# Altium schematic sheet TopLevel.SchDoc
size A4
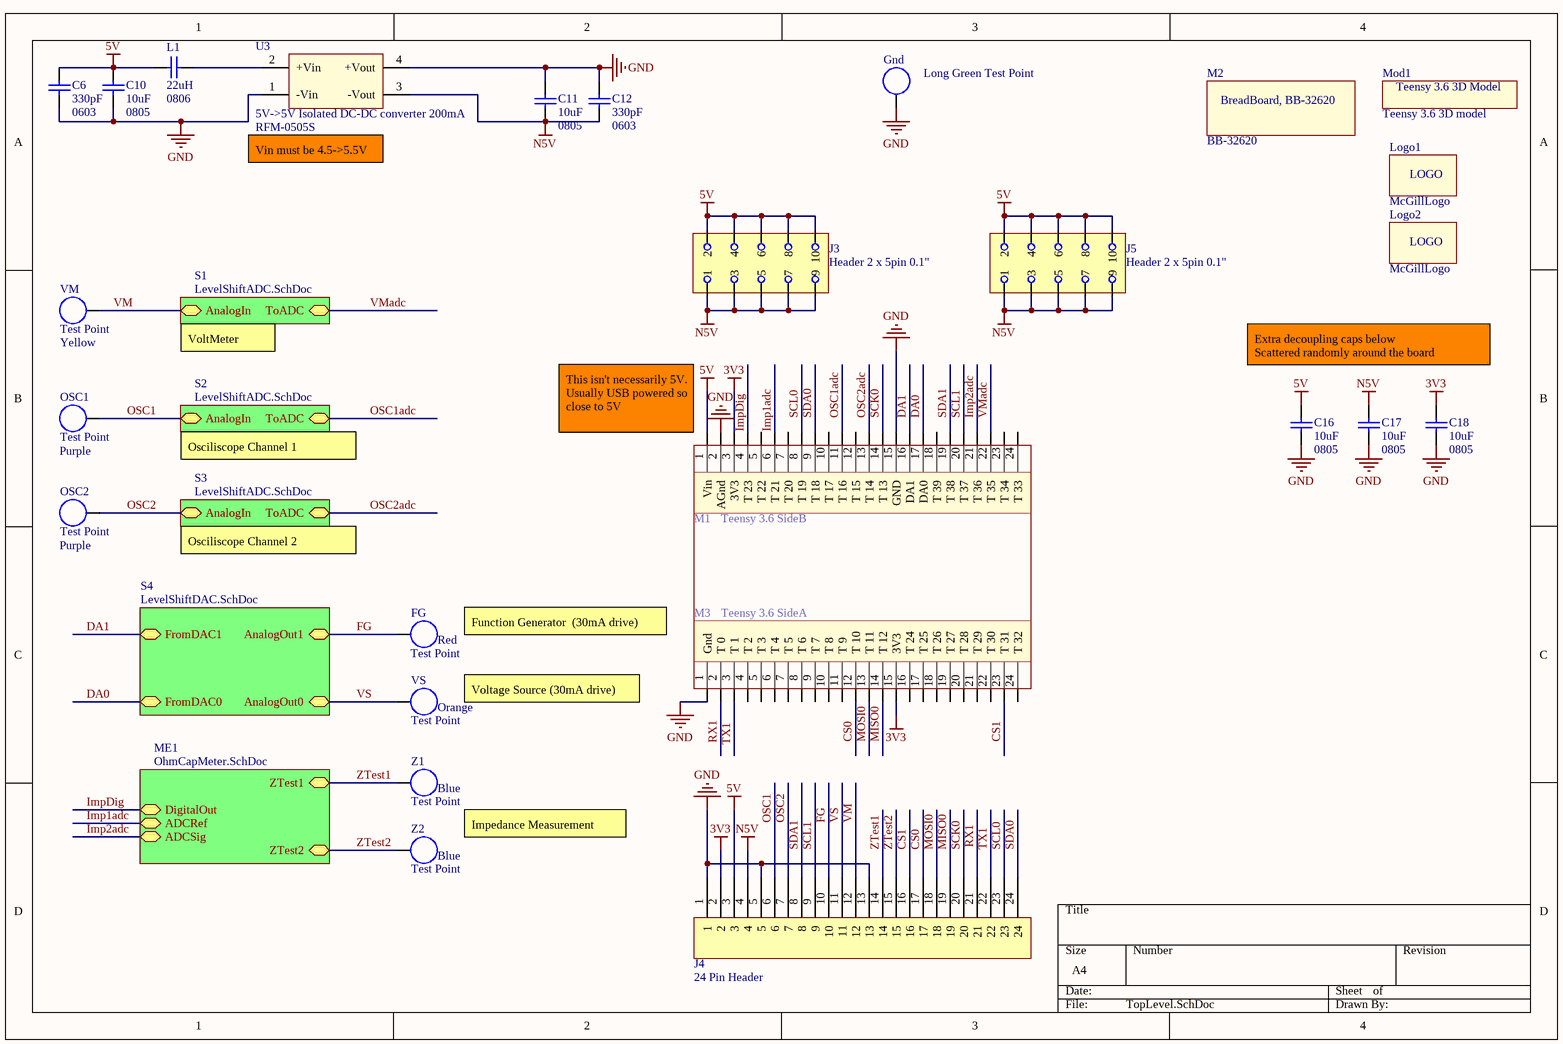
[diagram p0: TopLevel.SchDoc]

## Parts
C6  330pF  [0603]
C10  10uF  [0805]
C11  10uF  [0805]
C12  330pF  [0603]
C16  10uF  [0805]
C17  10uF  [0805]
C18  10uF  [0805]
FG  Test Point  Param: Red  [TestPoint]
Gnd  Long Green Test Point  [TestPoint]
J3  Header 2 x 5pin 0.1"  [Header2x5]
J4  24 Pin Header  [Header24Male]
J5  Header 2 x 5pin 0.1"  [Header2x5]
L1  22uH  [0806]
Logo1  McGillLogo  [McGillLogo1]  (no BOM)
Logo2  McGillLogo  [McGillLogo1]  (no BOM)
M1  Teensy 3.6 SideB  [Header24Female]
M2  BB-32620  (mechanical)
M3  Teensy 3.6 SideA  [Header24Female]
Mod1  Teensy 3.6 3D model  [Teensy3.6 Model No pins]  (no BOM)
OSC1  Test Point  Param: Purple  [TestPoint]
OSC2  Test Point  Param: Purple  [TestPoint]
U3  RFM-0505S  [RFM-0505S]
VM  Test Point  Param: Yellow  [TestPoint]
VS  Test Point  Param: Orange  [TestPoint]
Z1  Test Point  Param: Blue  [TestPoint]
Z2  Test Point  Param: Blue  [TestPoint]

## Sub-sheets
ME1 = OhmCapMeter.SchDoc: DigitalOut, ADCRef, ADCSig, ZTest2, ZTest1
S1 = LevelShiftADC.SchDoc: AnalogIn, ToADC
S2 = LevelShiftADC.SchDoc: AnalogIn, ToADC
S3 = LevelShiftADC.SchDoc: AnalogIn, ToADC
S4 = LevelShiftDAC.SchDoc: FromDAC1, FromDAC0, AnalogOut1, AnalogOut0

## Nets
3V3: C18.2 J4.2 M1.3(3V3) M3.15(3V3)
5V: C6.1 C10.2 C16.2 J3.2 J3.4 J3.6 J3.8 J3.10 J4.3 J5.2 J5.4 J5.6 J5.8 J5.10 L1.1 M1.1(Vin)
GND: C6.2 C10.1 C11.2 C12.1 C16.1 C17.1 C18.1 Gnd.0 J4.1 J4.5 J4.13 M1.2(AGnd) M1.15(GND) M3.1(Gnd) U3.1(-Vin) U3.4(+Vout)
N5V: C11.1 C12.2 C17.2 J3.1 J3.3 J3.5 J3.7 J3.9 J4.4 J5.1 J5.3 J5.5 J5.7 J5.9 U3.3(-Vout)
CS0: J4.17 M3.12(T_10)
CS1: J4.16 M3.23(T_31)
DA0: M1.17(DA0) ; sheet S4/FromDAC0
DA1: M1.16(DA1) ; sheet S4/FromDAC1
FG: FG.0 J4.10 ; sheet S4/AnalogOut1
Imp1adc: M1.6(T_21) ; sheet ME1/ADCRef
Imp2adc: M1.21(T_36) ; sheet ME1/ADCSig
ImpDig: M1.4(T_23) ; sheet ME1/DigitalOut
MISO0: J4.19 M3.14(T_12)
MOSI0: J4.18 M3.13(T_11)
OSC1: J4.6 OSC1.0 ; sheet S2/AnalogIn
OSC1adc: M1.11(T_16) ; sheet S2/ToADC
OSC2: J4.7 OSC2.0 ; sheet S3/AnalogIn
OSC2adc: M1.13(T_14) ; sheet S3/ToADC
RX1: J4.21 M3.2(T_0)
SCK0: J4.20 M1.14(T_13)
SCL0: J4.23 M1.8(T_19)
SCL1: J4.9 M1.20(T_37)
SDA0: J4.24 M1.9(T_18)
SDA1: J4.8 M1.19(T_38)
TX1: J4.22 M3.3(T_1)
VM: J4.12 VM.0 ; sheet S1/AnalogIn
VMadc: M1.22(T_35) ; sheet S1/ToADC
VS: J4.11 VS.0 ; sheet S4/AnalogOut0
ZTest1: J4.14 Z1.0 ; sheet ME1/ZTest1
ZTest2: J4.15 Z2.0 ; sheet ME1/ZTest2
NetL1_2: L1.2 U3.2(+Vin)

Not connected (* = marked no-connect by the designer): M1 5(T_22) 7(T_20) 10(T_17) 12(T_15) 18(T_39) 23(T_34) 24(T_33); M3 4(T_2) 5(T_3) 6(T_4) 7(T_5) 8(T_6) 9(T_7) 10(T_8) 11(T_9) 16(T_24) 17(T_25) 18(T_26) 19(T_27) 20(T_28) 21(T_29) 22(T_30) 24(T_32)

## Notes on the sheet
- (near U3) Vin must be 4.5->5.5V
- VoltMeter
- Extra decoupling caps below
  Scattered randomly around the board
- Osciliscope Channel 1
- (near M1) This isn't necessarily 5V. Usually USB powered so close to 5V
- Osciliscope Channel 2
- Function Generator  (30mA drive)
- Voltage Source (30mA drive)
- Impedance Measurement
- (in symbol BreadBoard) BreadBoard, BB-32620
- (in symbol Logo) LOGO
- (in symbol RFM-0505S) 5V->5V Isolated DC-DC converter 200mA
- (in symbol Teensy 3.6 3D model) Teensy 3.6 3D Model

## Library data of the parts
C6 C12 = Cap0603: Capacitor, Ceramic, 0603; Manufacturer: Yageo; Manufacturers Part Number: CC0603KRX7R9BB331; Assembly Comments: none; Loaded: True; Value: 330pF, 50V; TechInf: *; Param1: *; Part constraints: CC0603KRX7R9BB331; Supplier 1: Digi-Key; Supplier Part Number 1: 311-1186-1-ND; SupplierUnitCost: $0.0449
C10 C11 C16-C18 = Cap0805: 0805; Manufacturer: Taiyo Yuden; Part constraints: EMK212BJ106KG-T; Assembly Comments: none; Loaded: True; Value: 10uF 16V; Manufacturers Part Number: EMK212BJ106KG-T; Supplier 1: Digi-Key; Supplier Part Number 1: 587-1295-1-ND; SupplierUnitCost: $0.078
FG = TestPoint: Manufacturer: Keystone Electronics; Part Constraints: 5005; Assembly Comments: none; Loaded: True; Manufacturers Part Number: Red - 5005; Supplier 1: Digi-Key; Supplier Part Number 1: 36-5005-ND; SupplierUnitCost: $0.15
Gnd = TestPoint: Test Point; Manufacturer: Keystone Electronics; Part Constraints: 5126; Assembly Comments: none; Loaded: True; Manufacturers Part Number: Green - 5126; Param: Green; Supplier 1: Digi-Key; Supplier Part Number 1: 36-5126-ND; SupplierUnitCost: $0.15
J3 J5 = Header2x5: Header, 0.1", 2 row 5 pins; Manufacturer: Wurth Electronics Inc.; Manufacturers Part Number: 61301021121; Assembly Comments: none; Loaded: True; Footprint: *; Part constraints: 61301021121; Supplier 1: Digi-Key; Supplier Part Number 1: 732-2672-ND; SupplierUnitCost: $1.11012
J4 = 24 Pin Header: Manufacturer: Wurth Electronics Inc.; Manufacturers Part Number: 61302411121; Assembly Comments: none; Loaded: True; Part Constraints: 61302411121; Supplier 1: Digi-Key; Supplier Part Number 1: 732-5331-ND; SupplierUnitCost: $0.93
L1 = CBC2016T220M: 0805; Manufacturer: Taiyo Yuden; Assembly Comments: none; Loaded: True; Value: 22uH, 240mA, 2.3 Ohm; Part constraints: CBC2016T220M; Manufacturers Part Number: CBC2016T220M; Supplier 1: Digi-Key; Supplier Part Number 1: 587-1609-1-ND; SupplierUnitCost: $0.23
Logo1 Logo2 = Logo
M1 = Teensy 3.6 SideB: Teensy 3.6 SideA; Manufacturer: Sullins Connector Solutions; Manufacturers Part Number: PPPC241LFBN-RC; Assembly Comments: none; Loaded: True; Part constraints: PPPC241LFBN-RC; Supplier 1: Digi-Key; Supplier Part Number 1: S7057-ND; SupplierUnitCost: $1.57
M2 = BreadBoard: Breadboard BB-32620; Manufacturer: Bud Industries; Assembly Comments: none; Loaded: True; Manufacturers Part Number: BB-32620; Part constraints: BB-32620; Supplier 1: Digi-Key; Supplier Part Number 1: 377-2091-ND; SupplierUnitCost: $9.499
M3 = Teensy 3.6 SideA: Manufacturer: Sullins Connector Solutions; Manufacturers Part Number: PPPC241LFBN-RC; Assembly Comments: none; Loaded: True; Part constraints: PPPC241LFBN-RC; Supplier 1: Digi-Key; Supplier Part Number 1: S7057-ND; SupplierUnitCost: $1.57
Mod1 = Teensy 3.6 3D model: Manufacturer: SparkFun Electronics; Manufacturers Part Number: DEV-14058; Assembly Comments: none; Loaded: True; Part Constraints: DEV-14058; Supplier 1: Digi-Key; Supplier Part Number 1: 1568-1465-ND; SupplierUnitCost: $55.61
OSC1 OSC2 = TestPoint: Manufacturer: Keystone Electronics; Part Constraints: 5124; Assembly Comments: none; Loaded: True; Manufacturers Part Number: Purple - 5124; Supplier 1: Digi-Key; Supplier Part Number 1: 36-5124-ND; SupplierUnitCost: $0.15
U3 = RFM-0505S: 5V->5V DC-DC converter; Manufacturer: Recom Power; Assembly Comments: none; Loaded: True; Manufacturers Part Number: RFM-0505S; Supplier 1: Digi-Key; Supplier Part Number 1: 945-3159-ND; SupplierUnitCost: $1.24; Part constraints: RFM-0505S
VM = TestPoint: Manufacturer: Keystone Electronics; Part Constraints: 5009; Assembly Comments: none; Loaded: True; Manufacturers Part Number: Yellow - 5009; Supplier 1: Digi-Key; Supplier Part Number 1: 36-5009-ND; SupplierUnitCost: $0.15
VS = TestPoint: Manufacturer: Keystone Electronics; Part Constraints: 5008; Assembly Comments: none; Loaded: True; Manufacturers Part Number: Orange - 5008; Supplier 1: Digi-Key; Supplier Part Number 1: 36-5008-ND; SupplierUnitCost: $0.15
Z1 Z2 = TestPoint: Manufacturer: Keystone Electronics; Part Constraints: 5122; Assembly Comments: none; Loaded: True; Manufacturers Part Number: Blue - 5122; Supplier 1: Digi-Key; Supplier Part Number 1: 36-5122-ND; SupplierUnitCost: $0.15